# Altium schematic sheet radiotestconnector.SchDoc
size 297 x 209 mm
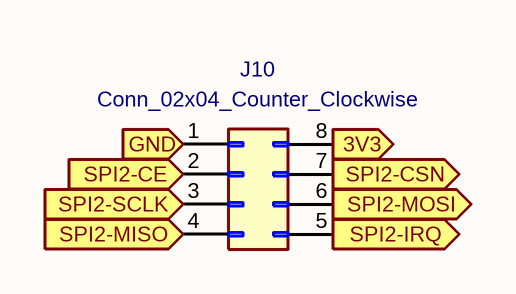
[diagram p0: radiotestconnector.SchDoc]

## Parts
J10  Conn_02x04_Counter_Clockwise

## Ports
3V3 (in), GND (in), SPI2-CE (in), SPI2-CSN (in), SPI2-IRQ (out), SPI2-MISO (out), SPI2-MOSI (in), SPI2-SCLK (in)

## Nets
3V3: J10.8(Pin_8) ; port 3V3
GND: J10.1(Pin_1) ; port GND
SPI2-CE: J10.2(Pin_2) ; port SPI2-CE
SPI2-CSN: J10.7(Pin_7) ; port SPI2-CSN
SPI2-IRQ: J10.5(Pin_5) ; port SPI2-IRQ
SPI2-MISO: J10.4(Pin_4) ; port SPI2-MISO
SPI2-MOSI: J10.6(Pin_6) ; port SPI2-MOSI
SPI2-SCLK: J10.3(Pin_3) ; port SPI2-SCLK

## Notes on the sheet
- 1
- 2
- 3
- 4
- 5
- 6
- A
- B
- C
- D
- Title:
- File: radiotestconnector.kicad_sch
- Sheet: /
- KiCad E.D.A.  kicad (5.1.4)-1
- Size: A4
- Date:
- Rev:
- Id: 1/1

## Library data of the parts
J10 = Conn_02x04_Counter_Clockwise: Value: Conn_02x04_Counter_Clockwise